# EAGLE design board (EAGLE 9.0.0)
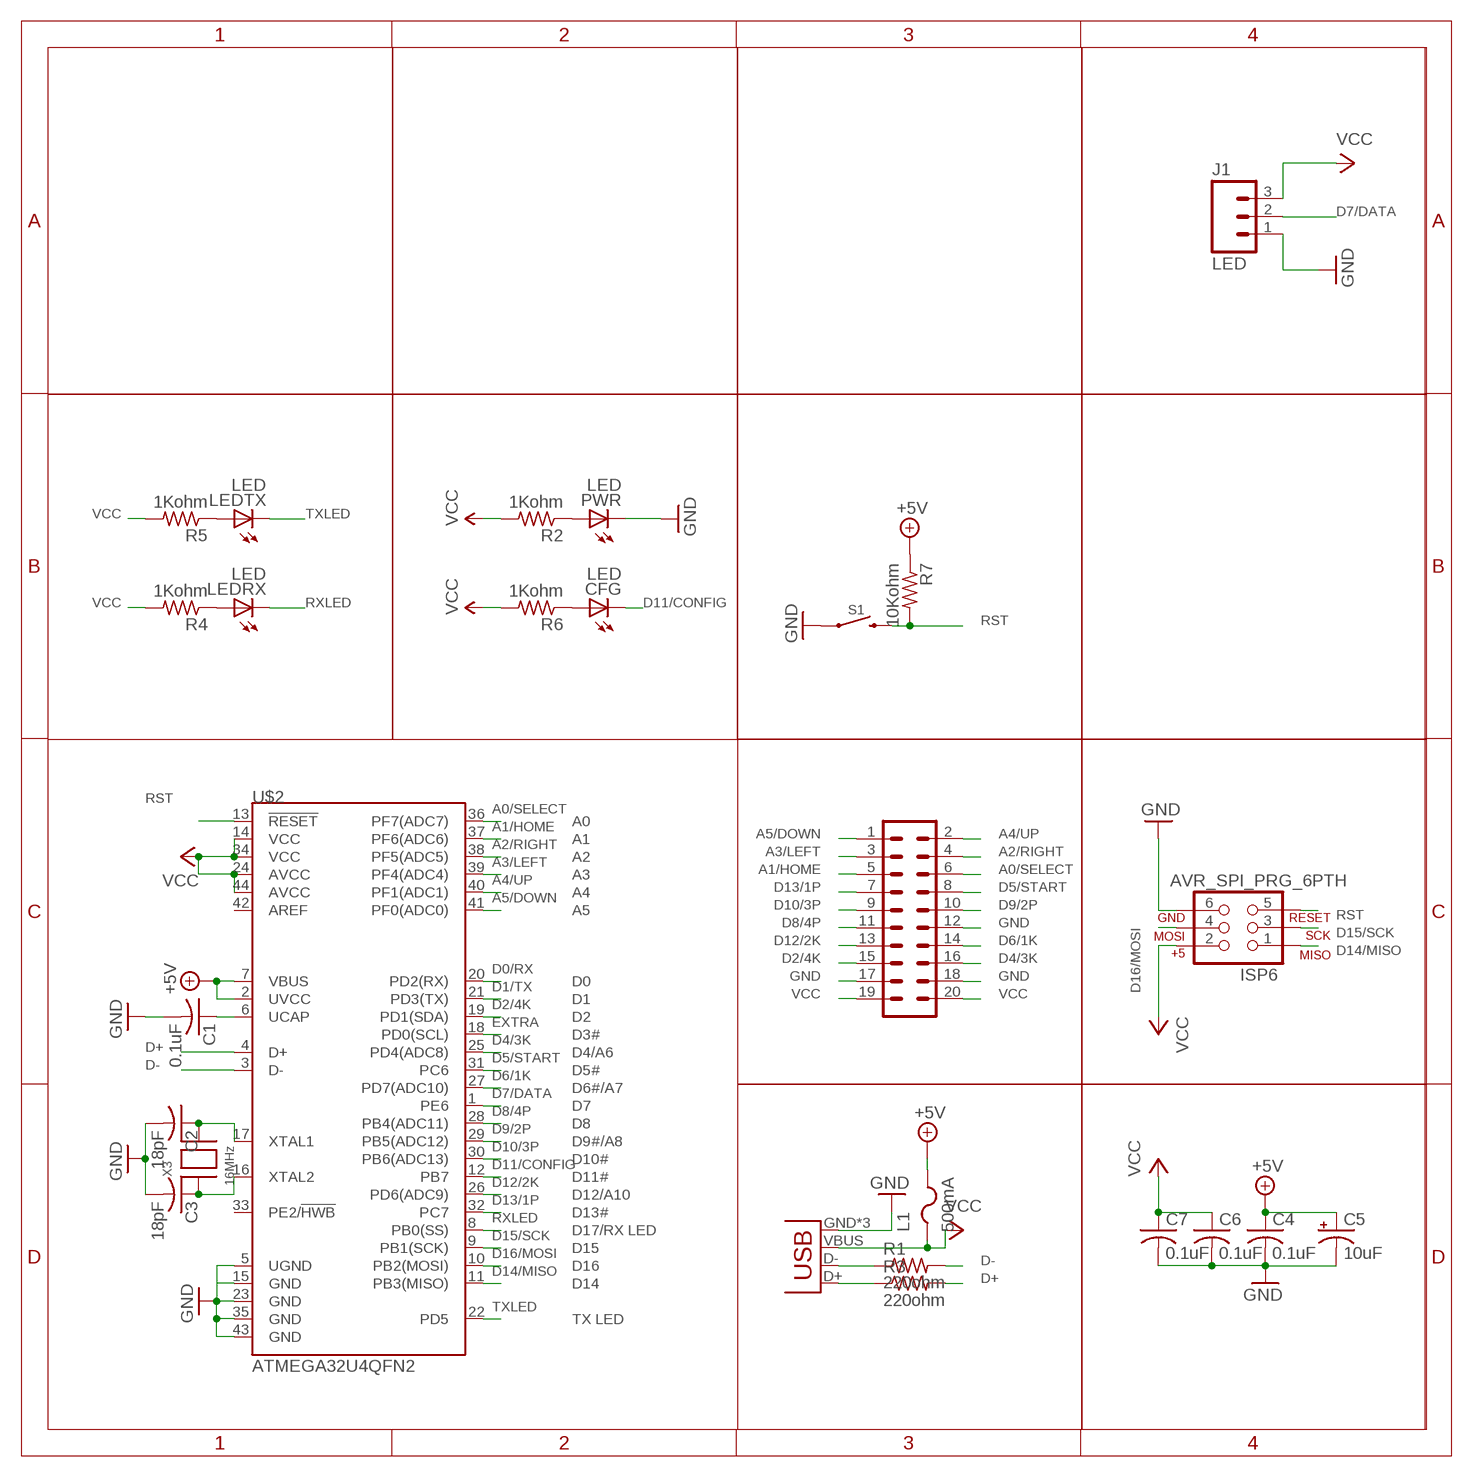
[diagram p0: schematic, sheet 1]

## Parts
C1  0.1uF  C-USC0603  [C0603]
C2  18pF  C-USC0603  [C0603]
C3  18pF  C-USC0603  [C0603]
C4  0.1uF  C-USC0603  [C0603]
C5  10uF  10UF-POLAR-0603-6.3V-20%(TANT)  [0603-POLAR]
C6  0.1uF  C-USC0603  [C0603]
C7  0.1uF  C-USC0603  [C0603]
CFG  LED  LEDCHIPLED_0603  [CHIPLED_0603]
CN1  USB-MICROB  [USB-MICROB]
ISP6  AVR_SPI_PRG_6PTH  [2X3]
J1  LED  M03JST-PTH-VERT  [JST-3-PTH-VERT]
L1  500mA  PTCFUSE-1206  [R1206]
LEDRX  LED  LEDCHIPLED_0603  [CHIPLED_0603]
LEDTX  LED  LEDCHIPLED_0603  [CHIPLED_0603]
PWR  LED  LEDCHIPLED_0603  [CHIPLED_0603]
R1  220ohm  R-US_R0603  [R0603]
R2  1Kohm  R-US_R0603  [R0603]
R3  220ohm  R-US_R0603  [R0603]
R4  1Kohm  R-US_R0603  [R0603]
R5  1Kohm  R-US_R0603  [R0603]
R6  1Kohm  R-US_R0603  [R0603]
R7  10Kohm  R-US_R0603  [R0603]
S1  MOMENTARY-SWITCH-SPST-SMD-4.6X2.8MM  [TACTILE_SWITCH_SMD_4.6X2.8MM]
U$1  M10X2  [2X10]
U$2  ATMEGA32U4QFN2  [SPARKFUN-DIGITALIC_QFN-44-NOPAD]
X3  16MHz  XTALNX5032  [NX5032]

## Nets
+5V: C4.1 C5.+ L1.2 R7.1 U$2.2(UVCC) U$2.7(VBUS)
A0/SELECT: U$1.6 U$2.36(PF7(ADC7))
A1/HOME: U$1.5 U$2.37(PF6(ADC6))
A2/RIGHT: U$1.4 U$2.38(PF5(ADC5))
A3/LEFT: U$1.3 U$2.39(PF4(ADC4))
A4/UP: U$1.2 U$2.40(PF1(ADC1))
A5/DOWN: U$1.1 U$2.41(PF0(ADC0))
D0/RX: U$2.20(PD2(RX))
D1/TX: U$2.21(PD3(TX))
D2/4K: U$1.15 U$2.19(PD1(SDA))
D4/3K: U$1.16 U$2.25(PD4(ADC8))
D5/START: U$1.8 U$2.31(PC6)
D6/1K: U$1.14 U$2.27(PD7(ADC10))
D7/DATA: J1.2 U$2.1(PE6)
D8/4P: U$1.11 U$2.28(PB4(ADC11))
D9/2P: U$1.10 U$2.29(PB5(ADC12))
D10/3P: U$1.9 U$2.30(PB6(ADC13))
D11/CONFIG: CFG.C U$2.12(PB7)
D12/2K: U$1.13 U$2.26(PD6(ADC9))
D13/1P: U$1.7 U$2.32(PC7)
D14/MISO: ISP6.1 U$2.11(PB3(MISO))
D15/SCK: ISP6.3 U$2.9(PB1(SCK))
D16/MOSI: ISP6.4 U$2.10(PB2(MOSI))
D+: R3.2 U$2.4(D+)
D-: R1.2 U$2.3(D-)
EXTRA: U$2.18(PD0(SCL))
GND: C1.2 C2.2 C3.2 C4.2 C5.- C6.2 C7.2 CN1.GND CN1.MT1(GND) CN1.MT2(GND) ISP6.6 J1.1 PWR.C S1.1 S1.2 U$1.12 U$1.17 U$1.18 U$2.5(UGND) U$2.15(GND) U$2.23(GND) U$2.35(GND) U$2.43(GND)
N$1: CFG.A R6.1
N$2: PWR.A R2.1
N$3: CN1.D+ R3.1
N$5: CN1.D- R1.1
N$6: LEDRX.A R4.1
N$7: LEDTX.A R5.1
N$8: C2.1 U$2.17(XTAL1) X3.P$2
N$9: C3.1 U$2.16(XTAL2) X3.P$1
RST: ISP6.5 R7.2 S1.3 S1.4 U$2.13(!RESET)
RXLED: LEDRX.C U$2.8(PB0(SS))
TXLED: LEDTX.C U$2.22(PD5)
UCAP: C1.1 U$2.6(UCAP)
VCC: C6.1 C7.1 CN1.VBUS ISP6.2 J1.3 L1.1 R2.2 R4.2 R5.2 R6.2 U$1.19 U$1.20 U$2.14(VCC) U$2.24(AVCC) U$2.34(VCC) U$2.44(AVCC)
Unconnected: U$2.33(PE2/!HWB) U$2.42(AREF)

## Library data of the parts
C1-C4 C6 C7 = adafruit:C-US: CAPACITOR, American symbol
C5 = SparkFun-Capacitors:10UF-POLAR: 10.0µF polarized capacitors A capacitor is a passive two-terminal electrical component used to store electrical energy temporarily in an electric field.; PROD_ID: CAP-13210
CFG LEDRX LEDTX PWR = adafruit:LED: LED OSRAM: - CHIPLED LG R971, LG N971, LY N971, LG Q971, LY Q971, LO R971, LY R971 LH N974, LH R974 LS Q976, LO Q976, LY Q976 LO Q996 - Hyper CHIPLED LW Q18S LB Q993, LB Q99A, LB R99A - SideLED LS A670, LO A670, LY A670, LG A670, LP A670 LB A673, LV A673, LT A673, LW A673 LH A674 LY A675 LS A676, LA A676, LO A676, LY A676, LW A676 LS A679, LY A679, LG A679 - Hyper Micro SIDELED® LS Y876, LA Y876, LO Y876, LY Y876 LT Y87S - SmartLED LW L88C, LW L88S LB L89C, LB L89S, LG L890 LS L89K, LO L89K, LY L89K LS L896, LA L896, LO L896, LY L896 - TOPLED LS T670, LO T670, LY T670, LG T670, LP T670 LSG T670, LSP T670, LSY T670, LOP T670, LYG T670 LG T671, LOG T671, LSG T671 LB T673, LV T673, LT T673, LW T673 LH T674 LS T676, LA T676, LO T676, LY T676, LB T676, LH T676, LSB T676, LW T676 LB T67C, LV T67C, LT T67C, LS T67K, LO T67K, LY T67K, LW E67C LS E67B, LA E67B, LO E67B, LY E67B, LB E67C, LV E67C, LT E67C LW T67C LS T679, LY T679, LG T679 LS T770, LO T770, LY T770, LG T770, LP T770 LB T773, LV T773, LT T773, LW T773 LH T774 LS E675, LA E675, LY E675, LS T675 LS T776, LA T776, LO T776, LY T776, LB T776 LHGB T686 LT T68C, LB T68C - Hyper Mini TOPLED® LB M676 - Mini TOPLED Santana® LG M470 LS M47K, LO M47K, LY M47K Source: http://www.osram.convergy.de/
CN1 = SparkFun-Connectors:USB: USB Connectors USB-B-PTH is fully proven SKU : PRT-00139/CONN-08278 USB-miniB is fully proven SKU : PRT-00587 USB-A-PCB is untested. USB-A-H is throughly reviewed, but untested. Spark Fun Electronics SKU : PRT-00437 USB-B-SMT is throughly reviewed, but untested. Needs silkscreen touching up. USB-A-S has not been used/tested USB-MB-H has not been used/tested USB-MICROB has been used. CONN-09505; PROD_ID: CONN-09505
ISP6 = SparkFun-Connectors:AVR_SPI_PRG_6: AVR ISP 6 Pin This is the reduced ISP connector for AVR programming. Common on Arduino. This footprint will take up less PCB space and can be used with a 10-pin to 6-pin adapter such as SKU: BOB-08508 **Special note about "TEST_POINT" package. The stop mask is on the top side, so if you want your programming test points to be on the bottom of your board, make sure to place this package on the bottom side of the board. This also ensure that the orientation to program from the bottom side will be correct.
J1 = SparkFun-Connectors:M03: Header 3 Standard 3-pin 0.1" header. Use with straight break away headers (SKU : PRT-00116), right angle break away headers (PRT-00553), swiss pins (PRT-00743), machine pins (PRT-00117), and female headers (PRT-00115). Molex polarized connector foot print use with SKU : PRT-08232 with associated crimp pins and housings.
L1 = adafruit:PTCFUSE: PTC fuses, resettable thermistors
R1-R7 = adafruit:R-US_: RESISTOR, American symbol
S1 = SparkFun-Switches:MOMENTARY-SWITCH-SPST: Momentary Switch (Pushbutton) - SPST Normally-open (NO) SPST momentary switches (buttons, pushbuttons). Variants PTH-12MM - 12mm square, through-hole Momentary Pushbutton Switch - 12mm Square <https://www.sparkfun.com/products/9190> (COM-09190) PTH-6.0MM, PTH-6.0MM-KIT - 6.0mm square, through-hole Mini Pushbutton Switch <https://www.sparkfun.com/products/97> (COM-00097) KIT package intended for soldering kit's - only one side of pads' copper is exposed. PTH-RIGHT-ANGLE-KIT - Right-angle, through-hole Right Angle Tactile Button <https://www.sparkfun.com/products/10791> - Used on SparkFun BigTime Watch Kit <https://www.sparkfun.com/products/11734> SMD-12MM - 12mm square, surface-mount Tactile Button - SMD (12mm) <https://www.sparkfun.com/products/12993> (COM-12993) Used on SparkFun PicoBoard <https://www.sparkfun.com/products/11888> SMD-4.5MM - 4.5mm Square Trackball Switch Used on SparkFun Blackberry Trackballer Breakout <https://www.sparkfun.com/products/13169> SMD-4.6MMX2.8MM - 4.60mm x 2.80mm, surface mount Used on SparkFun SAMD21 Mini Breakout <https://www.sparkfun.com/products/13664> SMD-5.2MM, SMD-5.2-REDUNDANT - 5.2mm square, surface-mount Mini Pushbutton Switch - SMD <https://www.sparkfun.com/products/8720> (COM-08720) Used on Arduino Pro Mini <https://www.sparkfun.com/products/11114> REDUNDANT package connects both switch circuits together SMD-6.0X3.5MM - 6.0 x 3.5mm, surface mount Momentary Reset Switch SMD <https://www.sparkfun.com/products/8229> (COM-08229) SMD-6.2MM-TALL - 6.2mm square, surface mount Tactile Button - SMD (6mm) <https://www.sparkfun.com/products/12992> Used on SparkFun Digital Sandbox <https://www.sparkfun.com/products/12651> SMD-RIGHT-ANGLE - Right-angle, surface mount Used on SparkFun Block for Intel® Edison - Arduino <https://www.sparkfun.com/products/13036>; PROD_ID: SWCH-13065
U$1 = SparkFun-Connectors:M10X2: This was SPECIALLY designed to be used with our Graphic LCD Backpack. Be sure you want to use this! It is not only staggered on each line of header holes, but IT IS ALSO offset of the center point of the top and bottom lines by 5 mil. This causes the headers to lock into place on the "standard" footprint on the LCD screen. The extra squares on the tdocu layer are there simply to reference other pins (if you were to actually populate a longer header than ten long - this is what we do with the backpacks).
U$2 = SparkFun-Retired:ATMEGA32U4: Atmel 44-pin 8-bit Microcontroller with 32KBytes of ISP Flash and USB Controller ----- Please use the QFN-44-NOPAD_1:1 package for the footprint of all boards using a 32U4. Route traces directly away from the pads as much as possible.
X3 = adaprog:XTAL

## Board
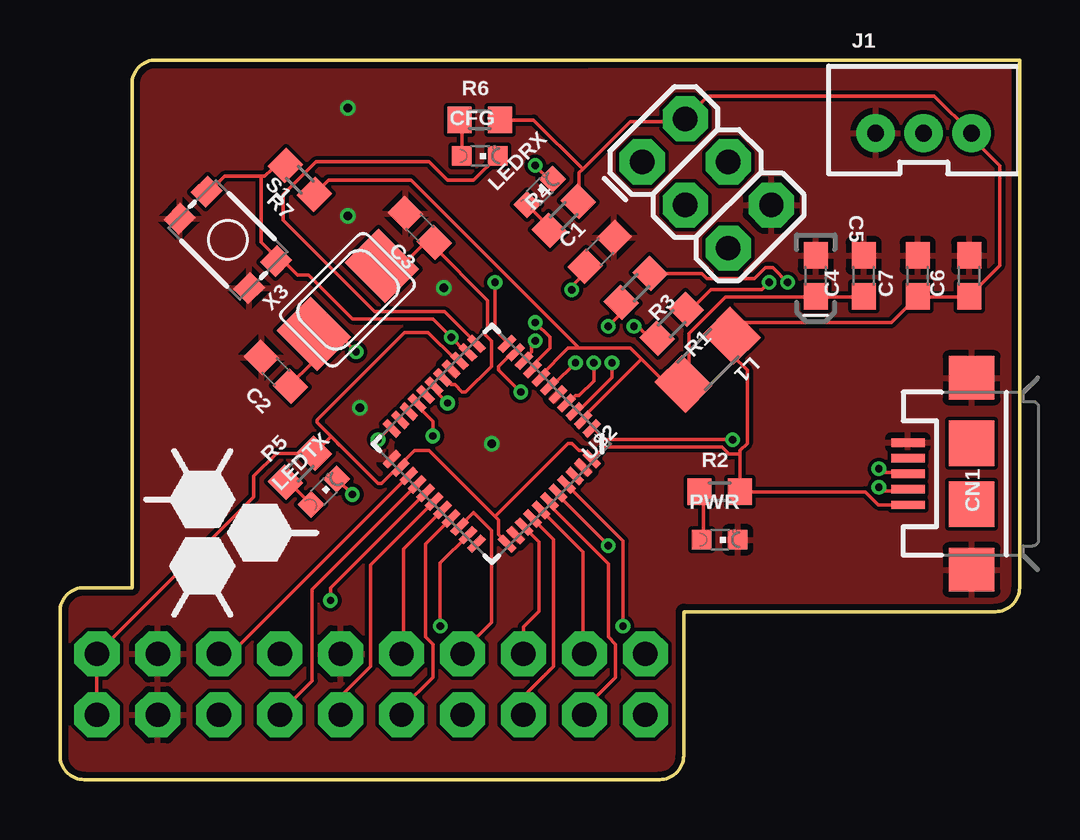
[diagram p1: board, top side]
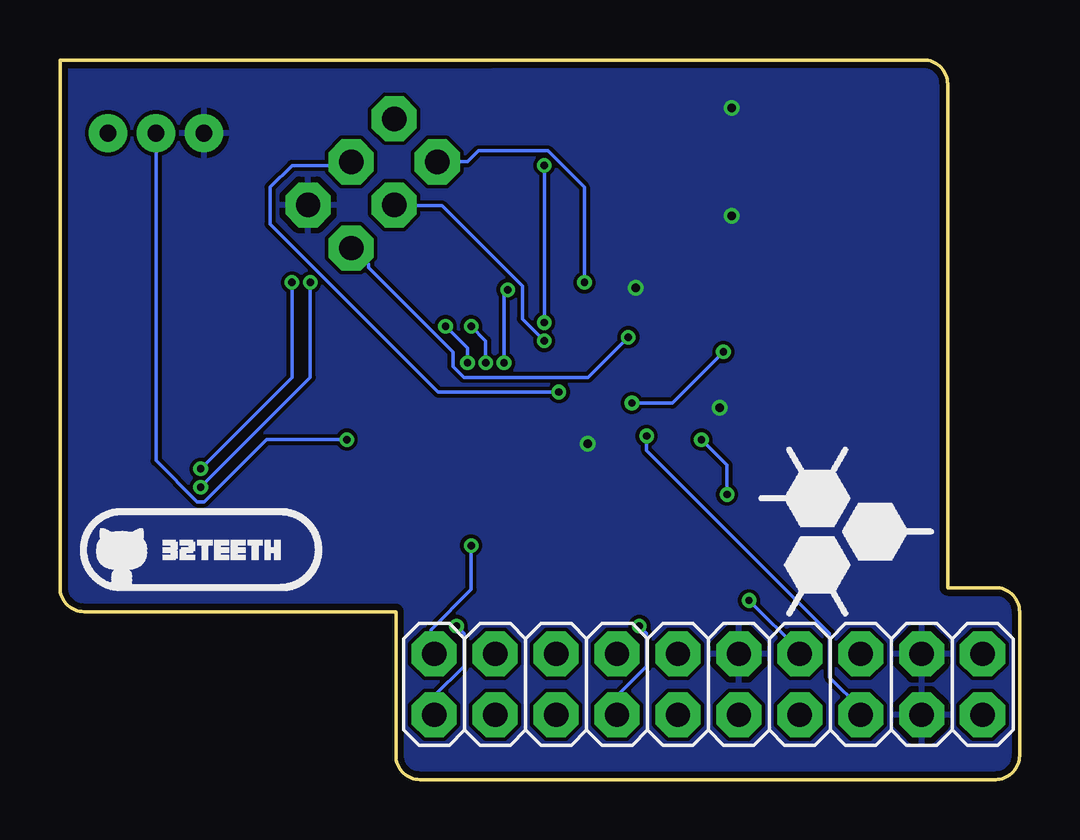
[diagram p2: board, bottom side, seen from below]

Size 40 x 30 mm. Coordinates in mm from the lower left corner, seen from the top.
Outline: 3,8 1,8 arc90 0,7 0,1 arc90 1,0 25,0 arc90 26,1 26,7 39,7 arc90 40,8 40,30 22,30 4,30 arc90 3,29 3,8
Copper layers (1*16): Top 0.035mm / dielectric 1.5mm / Bottom 0.035mm
Design rules "SeeedStudio_2layer_DRU_no_angle_20140221": minimum track width 6mil, minimum drill 12mil, track to track 6mil, track to pad 6mil, pad to pad 6mil, via to via 6mil, smd to smd 0mil, copper to edge 10mil, drill to drill 10mil, minimum pad ring 10mil, minimum via ring 6mil, stop-mask expansion 2mil, vias tented up to drill 100mil, thermal gap 10mil

### Footprints (pad centres in the part's own frame; a part is rotated, then mirrored left to right if it is on the bottom)
C0603 = smd 1.1 x 1: 1 -0.85,0; 2 0.85,0
0603-POLAR = smd 1.1 x 1: + 0.85,0; - -0.85,0
CHIPLED_0603 = smd 0.8 x 0.8: A 0,-0.75; C 0,0.75
USB-MICROB = smd 0.35 x 1.4: D+ 0,2.65; D- -0.65,2.65; GND 1.3,2.65; ID 0.65,2.65; VBUS -1.3,2.65 | smd 1.8 x 1.9: MT1 -4,0; MT2 4,0 | smd 1.9 x 1.9: P$1 -1.27,0; P$2 1.27,0
2X3 = drill 1.016 pad 1.88 octagon: 1 0,0; 2 0,2.54; 3 2.54,0; 4 2.54,2.54; 5 5.08,0; 6 5.08,2.54
JST-3-PTH-VERT = drill 0.7 pad 1.6: 1 -2,-0.55; 2 0,-0.55; 3 2,-0.55
R1206 = smd 1.6 x 1.803: 1 -1.422,0; 2 1.422,0
R0603 = smd 1 x 1.1: 1 -0.85,0; 2 0.85,0
TACTILE_SWITCH_SMD_4.6X2.8MM = smd 0.9 x 1: 1 -2.05,-0.8; 2 2.05,-0.8; 3 2.05,0.8; 4 -2.05,0.8
2X10 = drill 1.016 pad 1.88 octagon: 1 -11.43,-1.27; 2 -11.43,1.27; 3 -8.89,-1.27; 4 -8.89,1.27; 5 -6.35,-1.27; 6 -6.35,1.27; 7 -3.81,-1.27; 8 -3.81,1.27; 9 -1.27,-1.27; 10 -1.27,1.27; 11 1.27,-1.27; 12 1.27,1.27; 13 3.81,-1.27; 14 3.81,1.27; 15 6.35,-1.27; 16 6.35,1.27; 17 8.89,-1.27; 18 8.89,1.27; 19 11.43,-1.27; 20 11.43,1.27
SPARKFUN-DIGITALIC_QFN-44-NOPAD = smd 0.8 x 0.3: 1 -3.4,2.5; 2 -3.4,2; 3 -3.4,1.5; 4 -3.4,1; 5 -3.4,0.5; 6 -3.4,0; 7 -3.4,-0.5; 8 -3.4,-1; 9 -3.4,-1.5; 10 -3.4,-2; 11 -3.4,-2.5; 23 3.4,-2.5; 24 3.4,-2; 25 3.4,-1.5; 26 3.4,-1; 27 3.4,-0.5; 28 3.4,0; 29 3.4,0.5; 30 3.4,1; 31 3.4,1.5; 32 3.4,2; 33 3.4,2.5 | smd 0.3 x 0.8: 12 -2.5,-3.4; 13 -2,-3.4; 14 -1.5,-3.4; 15 -1,-3.4; 16 -0.5,-3.4; 17 0,-3.4; 18 0.5,-3.4; 19 1,-3.4; 20 1.5,-3.4; 21 2,-3.4; 22 2.5,-3.4; 34 2.5,3.4; 35 2,3.4; 36 1.5,3.4; 37 1,3.4; 38 0.5,3.4; 39 0,3.4; 40 -0.5,3.4; 41 -1,3.4; 42 -1.5,3.4; 43 -2,3.4; 44 -2.5,3.4
NX5032 = smd 2 x 2.4: P$1 2,0; P$2 -2,0

### Placement (x,y rotation side)
C1  22.5,22 45 top
C2  9,17 135 top
C3  15,23 135 top
C4  33.5,21 90 top
C5  31.5,21 270 top
C6  37.9,21 90 top
C7  35.75,21 90 top
CFG  17.5,26 270 top
CN1  38,12.75 90 top
ISP6  24.27,25.75 315 top
J1  36,27.5 0 top
L1  27,17.5 225 top
LEDRX  20,24.5 315 top
LEDTX  11,12 315 top
PWR  27.5,10 270 top
R1  25.5,19 225 top
R2  27.5,12 0 top
R3  24,20.5 225 top
R4  21,23.5 45 top
R5  10,13 45 top
R6  17.5,27.5 0 top
R7  10,25 135 top
S1  7,22.5 315 top
U$1  12.97,3.97 0 bottom
U$2  18,14 225 top
X3  12,20 45 top

### Tracks (layer width: path | path; a pad name or v marks a point on that pad's centre or on a via)
+5V
  Top 0.152: C4.1 33.38,20.12 31.55,20.12 C5.+ 31.47,20.12 27.74,20.12 26.21,18.59 26.21,16.71 L1.2 25.88,16.61 25.15,16.61 24.23,17.53 | 21.18,17.98 21.1,17.9 | 21.1,17.9 20.12,16.92 20.12,16.82 U$2.7 | 24.23,17.53 23.77,17.98 21.64,17.98 | 24.23,17.53 21.95,15.24 21.95,15.09 U$2.2 | 21.64,17.98 14.63,24.99 11.2,24.99 R7.1 | 21.1,17.9 21.18,17.98 | 21.18,17.98 21.64,17.98
A0/SELECT
  Top 0.152: U$1.6 19.32,6.37 19.96,7.01 19.96,9.91 U$2.36
A1/HOME
  Top 0.152: U$1.5 19.32,3.47 20.57,4.72 20.57,10.01 U$2.37
A2/RIGHT
  Top 0.152: U$1.4 21.79,5.31 21.79,9.5 U$2.38
A3/LEFT
  Top 0.152: U$2.39 20.42,11.58 20.42,11.43 22.86,8.99 22.86,5.94 23.16,5.64 23.16,4.27 21.86,2.96 U$1.3
A4/UP  (via drill 0.3)
  Top 0.152: v22.86,9.75 20.88,11.73 20.88,11.83 U$2.40
  Bottom 0.152: v22.86,9.75 22.86,7.92 24.54,6.25 24.54,5.33 U$1.2
A5/DOWN  (via drill 0.3)
  Top 0.152: v23.47,6.4 23.47,9.95 U$2.41
  Bottom 0.152: v23.47,6.4 23.16,6.1 23.16,4.72 24.4,3.49 U$1.1
D2/4K  (via drill 0.3)
  Top 0.152: v15.54,14.33 15.54,14.94 14.94,15.54 U$2.19
  Bottom 0.152: v15.54,14.33 15.54,13.72 7.92,6.1 7.92,4.27 6.62,2.96 U$1.15
D4/3K
  Top 0.152: U$1.16 7.12,5.24 U$2.25
D5/START
  Top 0.152: U$1.8 16.78,5.35 17.98,6.55 17.98,10.39 17.25,11.12 U$2.31
D6/1K  (via drill 0.3)
  Top 0.152: v11.28,7.47 11.28,7.99 U$2.27
  Bottom 0.152: v11.28,7.47 9.14,5.33 U$1.14
D7/DATA  (via drill 0.3)
  Top 0.152: v28.04,14.17 22.71,14.17 22.25,14.63 U$2.1
  Bottom 0.152: v28.04,14.17 31.39,14.17 33.98,11.58 34.29,11.58 36,13.29 J1.2
D8/4P
  Top 0.152: U$1.11 11.7,3.47 12.95,4.72 12.95,8.95 U$2.28
D9/2P
  Top 0.152: U$1.10 14.33,5.33 14.33,9.62 U$2.29
D10/3P
  Top 0.152: U$2.30 15.24,9.83 15.24,5.94 15.54,5.64 15.54,4.27 14.24,2.96 U$1.9
D11/CONFIG
  Top 0.152: CFG.C 17.24,24.99 16.15,24.99 15.39,25.76 10.67,25.76 9.3,24.38 9.3,23.32 13.11,19.51 16.03,19.51 U$2.12
D12/2K
  Top 0.152: U$1.13 9.16,2.76 10.52,4.12 10.52,7.93 U$2.26
D13/1P  (via drill 0.3)
  Top 0.152: v15.85,6.4 15.85,9.02 U$2.32
  Bottom 0.152: v15.85,6.4 15.54,6.1 15.54,4.72 16.78,3.49 U$1.7
D14/MISO  (via drill 0.3)
  Top 0.152: v18.14,20.73 18.14,18.75 18.59,18.29 U$2.11
  Bottom 0.152: v18.14,20.73 18.14,24.69 19.66,26.21 22.55,26.21 23.01,25.76 24.23,25.76 ISP6.1
D15/SCK  (via drill 0.3)
  Top 0.152: v19.81,18.29 19.66,18.14 19.66,17.83 19.36,17.53 U$2.9
  Bottom 0.152: v19.81,18.29 20.73,19.2 20.73,20.57 24.08,23.93 26.04,23.93 ISP6.3
D16/MOSI  (via drill 0.3)
  Top 0.152: v19.2,16.15 18.29,17.07 18.29,17.22 18.75,17.68 18.9,17.68 U$2.10
  Bottom 0.152: v19.2,16.15 24.23,16.15 31.24,23.16 31.24,24.69 30.33,25.6 27.89,25.6 ISP6.4
D+  (via drill 0.3)
  Top 0.152: v22.25,17.37 22.25,16.61 21.64,16 21.49,16 21.18,15.7 U$2.4 | v22.86,18.9 23.32,19.36 23.32,19.81 R3.2
  Bottom 0.152: v22.25,17.37 22.25,18.29 v22.86,18.9
D-  (via drill 0.3)
  Top 0.152: v23.01,17.37 23.01,16.76 21.64,15.39 21.49,15.39 U$2.3 | v23.93,18.9 24.08,18.9 24.54,18.44 24.84,18.44 R1.2
  Bottom 0.152: v23.01,17.37 23.01,17.98 v23.93,18.9
GND  (via drill 0.35)
  other vias: 18,14 16,20.5 12,23.5 12,28 12.5,15.5
  pour Top: 0,0 0,8 3,8 3,30 40,30 40,7 26,7 26,0
  pour Bottom: 0,8 3,8 3,30 40,30 40,7 26,7 26,0 0,0
N$1
  Top 0.152: CFG.A 16.76,26.06 16.76,27.43 R6.1
N$2
  Top 0.152: PWR.A 26.82,10.06 26.82,11.73 26.67,11.89 R2.1
N$3  (via drill 0.3)
  Top 0.152: v30.33,20.73 29.72,21.34 29.41,21.34 28.96,20.88 26.98,20.88 26.75,21.1 R3.1 | v34.14,12.95 34.29,12.8 35.2,12.8 CN1.D+
  Bottom 0.152: v30.33,20.73 30.33,16.76 v34.14,12.95
N$5  (via drill 0.3)
  Top 0.152: v34.14,12.19 34.29,12.04 35.2,12.04 CN1.D- | v29.57,20.73 29.26,20.42 27.13,20.42 26.31,19.6 R1.1
  Bottom 0.152: v29.57,20.73 29.57,16.76 v34.14,12.19
N$6
  Top 0.152: LEDRX.A 19.51,23.93 20.42,23.01 R4.1
N$7
  Top 0.152: LEDTX.A 10.36,11.58 9.45,12.5 R5.1
N$8  (via drill 0.3)
  Top 0.152: v16.15,15.7 15.7,16.15 15.7,16.31 U$2.17 | v12.34,17.83 11.73,18.44 10.67,18.44 X3.P$2 10.52,18.44 10.52,17.37 9.6,16.46 C2.1
  Bottom 0.152: v16.15,15.7 14.48,15.7 v12.34,17.83
N$9
  Top 0.152: 15.54,22.25 17.83,19.96 17.83,18.75 17.68,18.59 17.98,18.29 17.98,17.22 16.92,16.15 16.76,16.15 16.46,16.46 16.31,16.46 16.15,16.61 16,16.61 U$2.16 | 15.54,22.25 C3.1 15.54,22.25 | 15.54,22.25 15.09,22.25 14.33,21.49 13.56,21.49 X3.P$1
RST  (via drill 0.3)
  Top 0.152: 8.38,25.15 8.53,25.15 8.84,25.45 9.3,25.45 R7.2 | U$2.13 16.92,17.83 v16.31,18.44 15.54,19.2 12.19,19.2 10.36,21.03 9.91,21.03 9.45,21.49 9.14,21.49 S1.3 9.14,21.64 8.38,22.4 8.38,25.15 | S1.4 6.23,24.52 6.86,25.15 8.38,25.15
  Bottom 0.152: v16.31,18.44 17.98,16.76 23.16,16.76 23.62,17.22 23.62,17.83 27.13,21.34 27.13,21.49 27.74,22.1 ISP6.5
RXLED  (via drill 0.3)
  Top 0.152: v19.81,19.05 20.42,18.44 20.42,17.98 19.81,17.37 19.81,17.22 U$2.8 | v19.81,25.6 20.42,24.99 LEDRX.C
  Bottom 0.152: v19.81,25.6 v19.81,19.05
TXLED  (via drill 0.3)
  Top 0.152: v12.19,11.89 11.58,12.5 LEDTX.C | v13.26,14.17 13.72,14.63 U$2.22
  Bottom 0.152: v12.19,11.89 12.19,13.11 v13.26,14.17
UCAP  (via drill 0.3)
  Top 0.152: v21.49,17.37 20.57,16.46 20.42,16.46 U$2.6 | v21.34,20.42 21.34,20.57 21.79,21.03 21.79,21.34 C1.1
  Bottom 0.152: v21.49,17.37 21.49,20.27 v21.34,20.42
VCC
  Top 0.152: 11.58,14.02 11.8,13.8 | 11.8,13.8 13.26,12.34 13.41,12.34 14.02,12.95 14.17,12.95 U$2.24 14.17,13.11 14.78,13.72 15.39,13.72 18.14,10.97 | 10.67,13.72 R5.2 | 18.14,10.97 18.29,10.82 18.29,10.21 18.59,9.91 U$2.34 | 18.14,10.97 21.18,14.02 21.34,14.02 21.64,13.72 21.79,13.72 22.1,13.41 U$2.44 22.25,13.41 22.71,13.87 27.58,13.87 27.89,13.56 28.35,13.56 | 28.35,13.56 28.35,13.72 28.65,14.02 28.65,17.07 28.04,17.68 28.04,18.44 L1.1 28.55,19.05 34.65,19.05 C7.1 35.81,20.12 37.8,20.12 C6.1 39.17,21.42 39.17,25.6 38,26.77 J1.3 36.45,28.5 27.02,28.5 ISP6.2 25.95,27.43 23.77,27.43 21.79,25.45 | 28.35,13.56 28.35,12.04 R2.2 33.57,12 34.12,11.45 CN1.VBUS | 11.8,13.8 11.3,14.3 | 11.3,14.3 10.8,14.8 10.72,14.88 10.72,14.99 14.37,18.64 15.35,18.64 16.46,17.53 16.59,17.53 U$2.14 | R4.2 21.64,24.14 21.64,25.3 21.79,25.45 | R6.2 19.74,27.5 21.79,25.45 | U$1.19 U$1.20 8.08,11.78 8.08,12.65 9.03,13.6 R5.2 | R5.2 11.3,14.3